# EAGLE schematic processor (EAGLE 7.5.0)
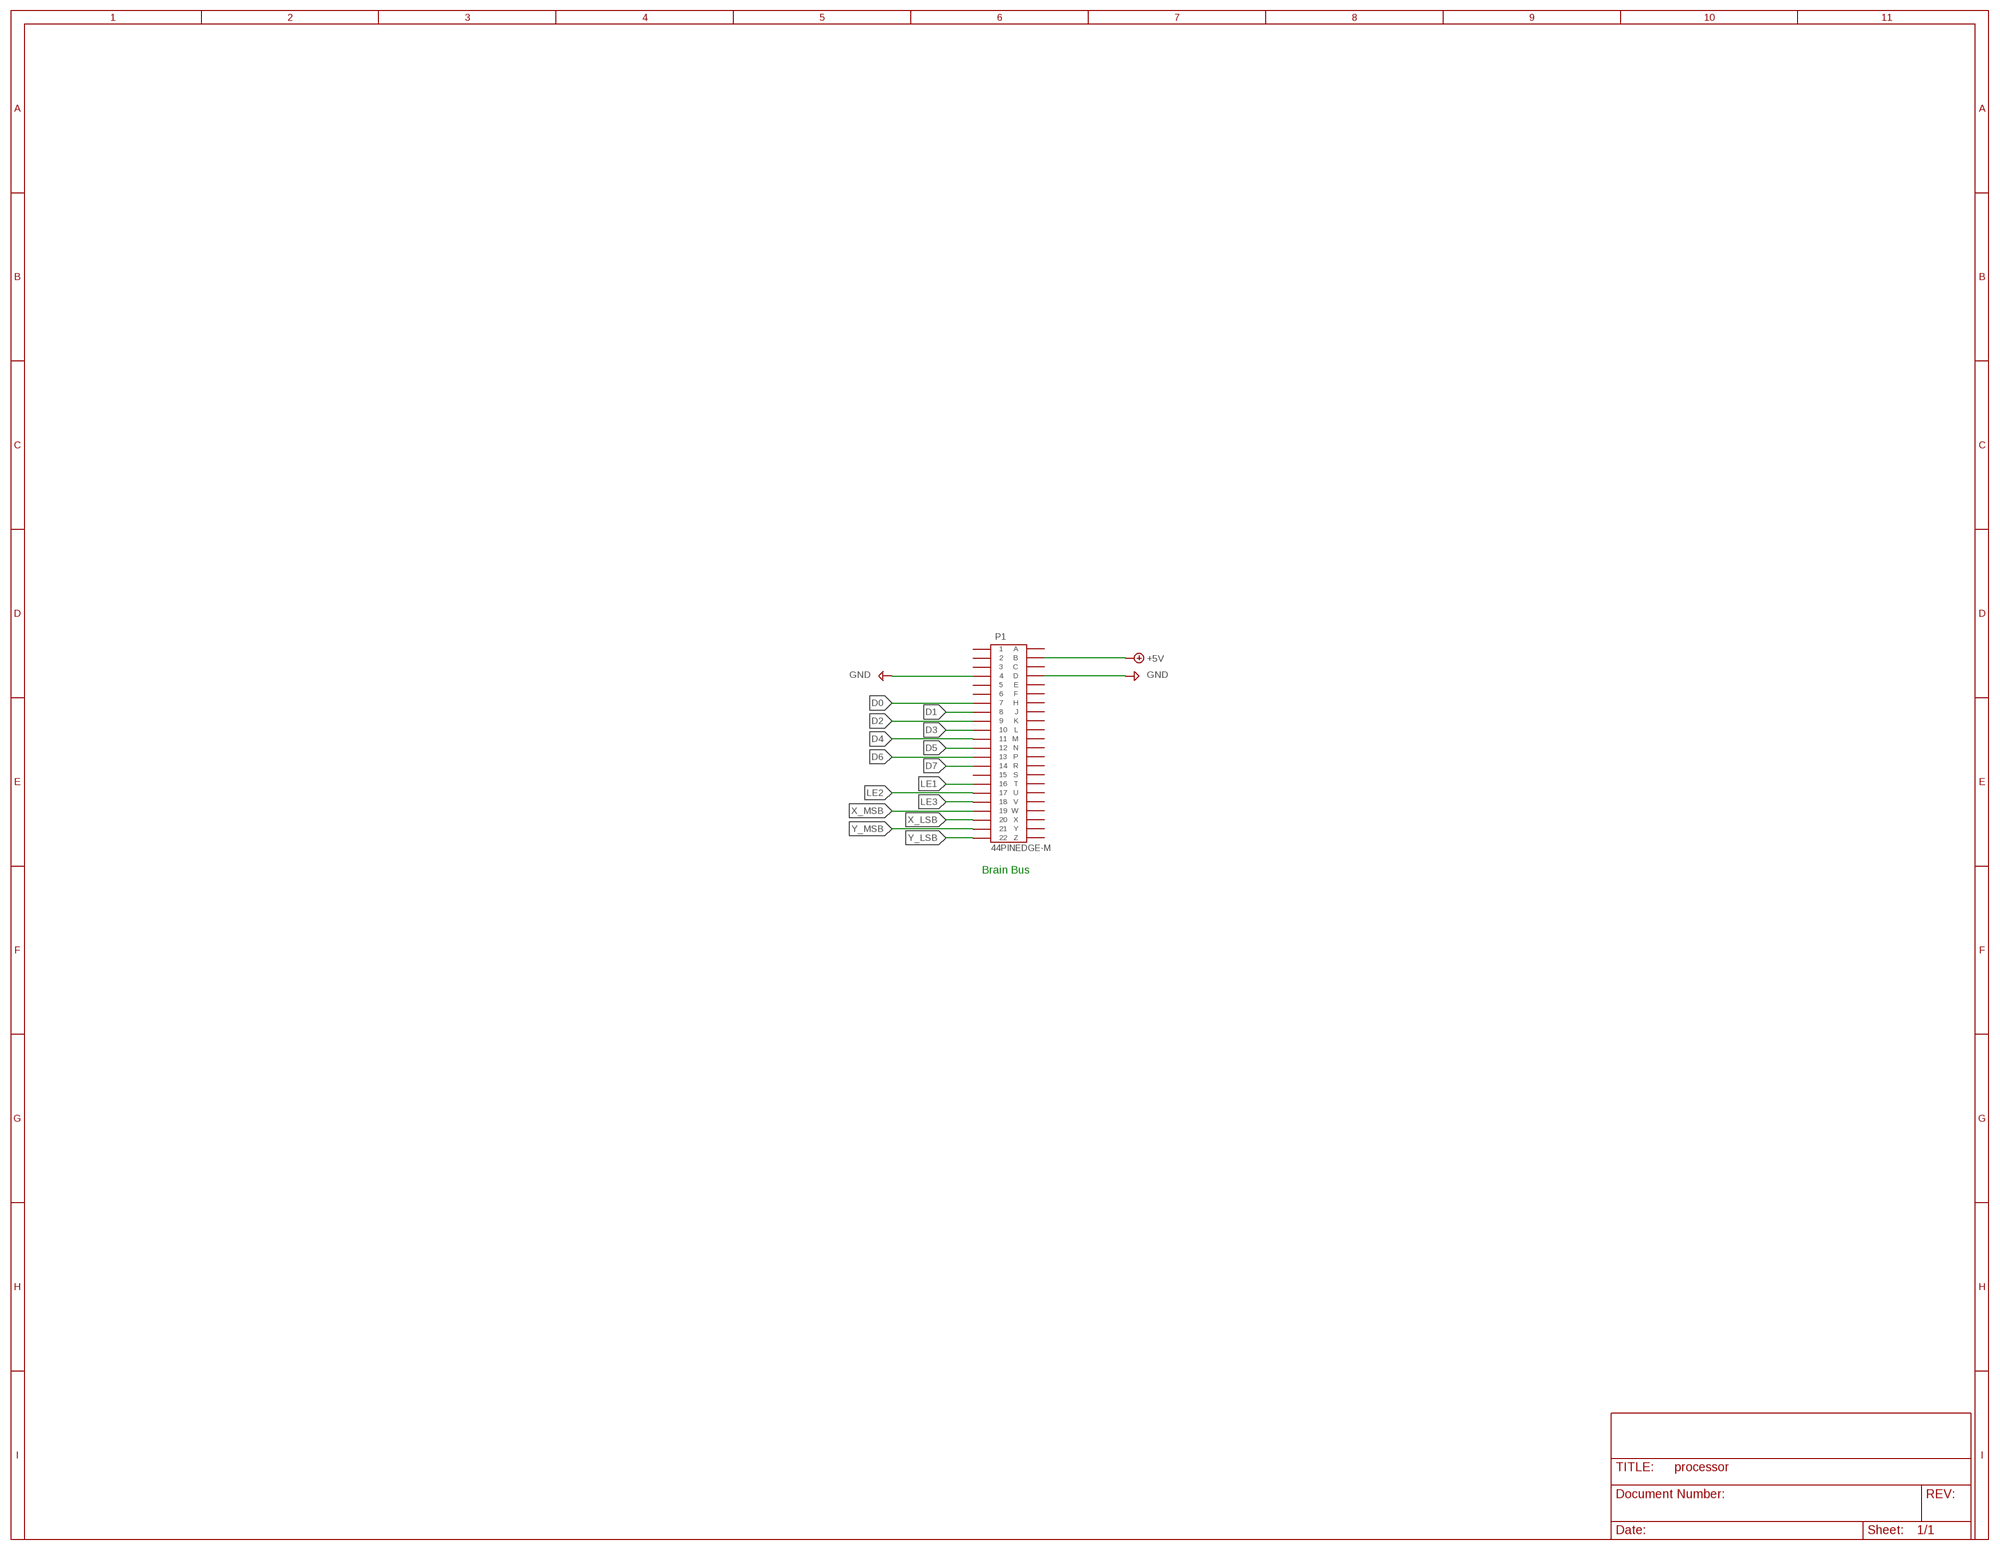
[diagram p0: schematic, sheet 1]

## Parts
P1  44PINEDGE-M  [44PINEDGE]

## Nets
+5V: P1.B
D0: P1.7
D1: P1.8
D2: P1.9
D3: P1.10
D4: P1.11
D5: P1.12
D6: P1.13
D7: P1.14
GND: P1.4 P1.D
LE1: P1.16
LE2: P1.17
LE3: P1.18
X_LSB: P1.20
X_MSB: P1.19
Y_LSB: P1.22
Y_MSB: P1.21
Unconnected: P1.1 P1.2 P1.3 P1.5 P1.6 P1.15 P1.A P1.C P1.E P1.F P1.H P1.J P1.K P1.L P1.M P1.N P1.P P1.R P1.S P1.T P1.U P1.V P1.W P1.X P1.Y P1.Z

## Notes on the sheet
- Brain Bus

## Library data of the parts
P1 = keiths:44PINEDGE-M: 44 PIN EDGE CONNECTOR FOR PCB